# Altium schematic sheet ADC_DAC_channel.SchDoc: RFMC
size 420 x 297 mm; CompanyName: WUT; DrawnBy: T. Przywozki; Organization: WUT ISE; Address1: Warsaw University of Technology; Address2: Nowowiejska 15/19 00-665 Warsaw; Address3: Tomasz.Przywozki@pw.edu.pl; Revision: 1; SheetNumber: 4; SheetTotal: 4; Project: RFMC; ModifiedBy: -; CheckedDate: -; Title2: ADC_DAC_channel; DivGrp: ISE; Designer: T. Przywozki; ModifiedDate: -; ProjectName: ADC/DAC MEZZANINE
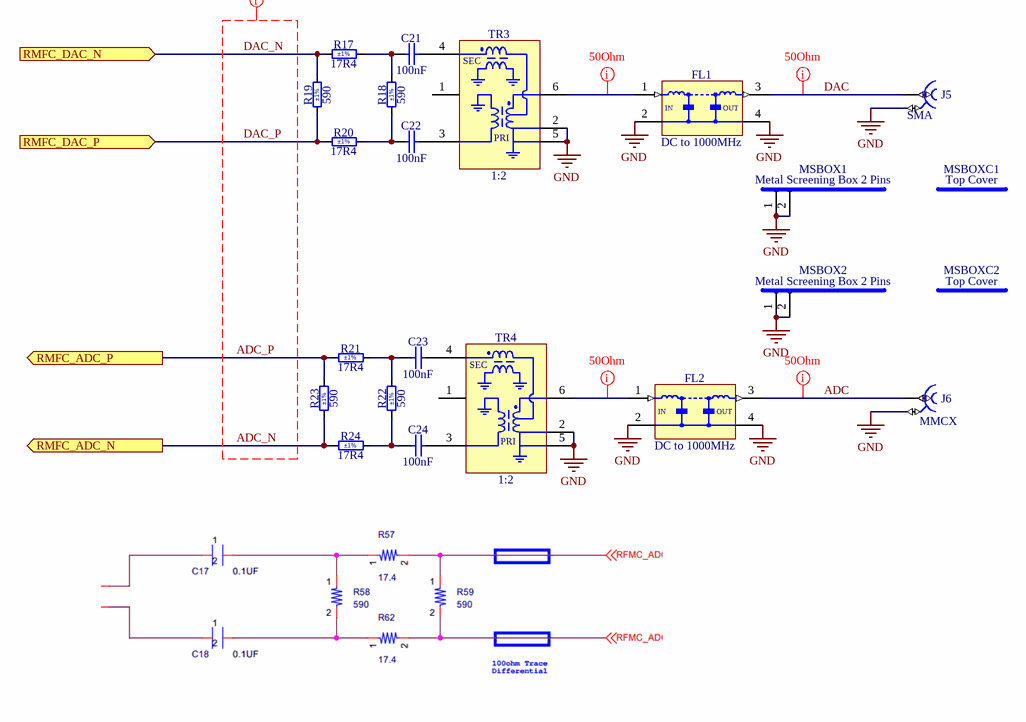
[diagram p0: ADC_DAC_channel.SchDoc]

## Parts
C21  100nF  [CAPC1005X55N]
C22  100nF  [CAPC1005X55N]
C23  100nF  [CAPC1005X55N]
C24  100nF  [CAPC1005X55N]
FL1  DC to 1000MHz  [FIL_MINI-CIRCUITS_FV1206]
FL2  DC to 1000MHz  [FIL_MINI-CIRCUITS_FV1206]
J5  SMA  [TELEGARTNER_J01151A0451]
J6  Family: MMCX  [HUBER-SUHNER_85_MMCX-50-0-1/111_OE]  (hidden comment: Coax_1Female_1Shield)
MSBOX1  Metal Screening Box 2 Pins  [MSBOX_WURTH_3670130]
MSBOX2  Metal Screening Box 2 Pins  [MSBOX_WURTH_3670130]
MSBOXC1  Top Cover  [MSBOX_WURTH_3671130]
MSBOXC2  Top Cover  [MSBOX_WURTH_3671130]
R17  17R4  Tolerance: ±1%  [RESC1005X40N]
R18  590  Tolerance: ±1%  [RESC1005X40N]
R19  590  Tolerance: ±1%  [RESC1005X40N]
R20  17R4  Tolerance: ±1%  [RESC1005X40N]
R21  17R4  Tolerance: ±1%  [RESC1005X40N]
R22  590  Tolerance: ±1%  [RESC1005X40N]
R23  590  Tolerance: ±1%  [RESC1005X40N]
R24  17R4  Tolerance: ±1%  [RESC1005X40N]
TR3  1:2  [XFMR_MINI-CIRCUITS_DB1627]
TR4  1:2  [XFMR_MINI-CIRCUITS_DB1627]

## Ports
RMFC_ADC_N (out), RMFC_ADC_P (out), RMFC_DAC_N (in), RMFC_DAC_P (in)

## Nets
GND: FL1.2(GND) FL1.4(GND) FL2.2(GND) FL2.4(GND) J5.2 J6.2 MSBOX1.1 MSBOX1.2 MSBOX2.1 MSBOX2.2 TR3.2(P) TR3.5(GND) TR4.2(P) TR4.5(GND)
ADC: FL2.3(RFOUT) J6.1
ADC_N: R23.1 R24.1 ; port RMFC_ADC_N
ADC_P: R21.1 R23.2 ; port RMFC_ADC_P
DAC: FL1.3(RFOUT) J5.1
DAC_N: R17.1 R19.2 ; port RMFC_DAC_N
DAC_P: R19.1 R20.1 ; port RMFC_DAC_P
NetC21_1: C21.1 R17.2 R18.2
NetC21_2: C21.2 TR3.4(SD)
NetC22_1: C22.1 R18.1 R20.2
NetC22_2: C22.2 TR3.3(S)
NetC23_1: C23.1 R21.2 R22.2
NetC23_2: C23.2 TR4.4(SD)
NetC24_1: C24.1 R22.1 R24.2
NetC24_2: C24.2 TR4.3(S)
NetFL1_1: FL1.1(RFIN) TR3.6(P1)
NetFL2_1: FL2.1(RFIN) TR4.6(P1)

Not connected (* = marked no-connect by the designer): TR3 1(NC); TR4 1(NC)

## Layout directives
net class SE50; net class ANALOG: ADC, DAC, NetFL1_1, NetFL2_1
net class ANALOG: ADC_N, ADC_P, DAC_N, DAC_P

## Notes on the sheet
- Project/Equipment
- Document
- Designer
- Drawn by
- Check.by
- Copyright WUT ISE 2021
  This documentation describes Open Hardware and is licensed under CERN OHL v.1.1. You may redistribute and modify this documentaction under the terms of the CERN OHL v1.1.
  (http://ohwr.org/CERNOHL). This documentation is dristributed WITHOUT ANY EXPRESS OR IMPLIED WARRANTY, INCLUDING OF MERCHANTABLITY, SATISFACTORY QUALITY AND FITNESS FOR A PARTICULAR PURPOSE. Please see the CERN OHL v.1.1 for applicable conditions
- File
- Last Mod.
- Print Date
- Sheet
- Size
- A3
- of
- Rev
- Contact:
- (in symbol FIL_MINI-CIRCUITS_LFCN-1000+) IN; OUT
- (in symbol XFMR_MINI-CIRCUITS_TCM2-33WX+) SEC; PRI

## Library data of the parts
C21-C24 = CC0402_100NF_16V_10%_X5R: Non-polarised capacitor; Part Description: SMD Multilayer Chip Ceramic Capacitor; Manufacturer: GENERIC; Manufacturer1 Part Number: GRM155R61C104KA88D; Voltage: 16V; TC: X5R; Tolerance: ±10%; Part Number: CC0402_100NF_16V_10%_X5R; Component Kind: Standard; Component Type: Standard; Pin Count: 2; Value: 100nF; Status: None; Manufacturer Part Number: CC0402_100NF_16V_10%_X5R; Case: 0402; Mounted: Yes; Socket: No; SMD: Yes; Sense: No; Manufacturer1 Example: MURATA; Manufacturer1 ComponentHeight: 0.55mm; HelpURL: \\cern.ch\dfs\Applications\Altium\Datasheets\CC0402_X5R_MURATA_GRM.pdf; Author: CERN DEM JLC; CreateDate: 10.12.2013; LatestRevisionDate: 10.12.2013
FL1 FL2 = FIL_MINI-CIRCUITS_LFCN-1000+: 50 Ohm Low Pass Filter; Part Number: FIL_MINI-CIRCUITS_LFCN-1000+; Component Kind: Standard; Component Type: Standard; Pin Count: 4; Value: DC to 1000MHz; Status: None; Part Description: 50 Ohm Low Pass Filter; Manufacturer: MINI-CIRCUITS; Manufacturer Part Number: LFCN-1000+; Mounted: Yes; Socket: No; SMD: Yes; Sense: No; ComponentHeight: 0.94mm; HelpURL: \\cern.ch\dfs\Applications\Altium\Datasheets\FIL_MINI-CIRCUITS_LFCN-1000+.pdf; Author: CERN DEM MR; CreateDate: 05.04.2019; LatestRevisionDate: 05.04.2019
J5 = TELEGARTNER_J01151A0451: Part Description: SMA 50 ohms Edge Mount Bulkhead Jack Receptacle; PressFit: No; Part Number: TELEGARTNER_J01151A0451; Component Kind: Standard; Component Type: Standard; Pin Count: 2; Family: SMA; Mounted: Yes; Socket: No; SMD: No; Sense: No; Status: None; Manufacturer: TELEGARTNER; Manufacturer Part Number: J01151A0451; ComponentHeight: 7mm; HelpURL: \\cern.ch\dfs\Applications\Altium\Datasheets\TELEGARTNER_J01151A0451.pdf; Author: CERN DEM JLC; CreateDate: 27.10.2016; LatestRevisionDate: 27.10.2016
J6 = HUBER-SUHNER_85_MMCX-50-0-1/111_OE: Part Description: MMCX 50 Ohms Right Angle PCB Jack; Manufacturer: HUBER+SUHNER; PressFit: No; Part Number: HUBER-SUHNER_85_MMCX-50-0-1/111_OE; Component Kind: Standard; Component Type: Standard; Pin Count: 2; Mounted: Yes; Socket: No; SMD: No; Sense: No; Status: None; Manufacturer Part Number: 85_MMCX-50-0-1/111_OE; ComponentHeight: 9.6mm; HelpURL: \\cern.ch\dfs\Applications\Altium\Datasheets\HUBER-SUHNER_85_MMCX-50-0-1-111_OE.pdf; Author: CERN DEM JLC; CreateDate: 06.11.2014; LatestRevisionDate: 06.11.2014
MSBOX1 MSBOX2 = MSBOX_WURTH_3670130: Part Description: Seamless Shielding Cabinet SMD-Frame WE-SHC (Two-Piece), Internal Dimensions 12.4 x 12.4mm; Manufacturer: WURTH; PressFit: No; Part Number: MSBOX_WURTH_3670130; Component Kind: Standard; Component Type: Standard; Pin Count: 2; PackageDescription: Seamless Shielding Cabinet SMD-Frame WE-SHC (Two-Piece), Internal Dimensions 12.4 x 12.4mm; Mounted: Yes; Socket: No; SMD: Yes; Sense: No; Status: None; Manufacturer Part Number: 3670130; ComponentHeight: 5.2mm; HelpURL: \\cern.ch\dfs\Applications\Altium\Datasheets\MSBOX_WURTH_3670130.pdf; Author: CERN DEM BC; CreateDate: 19.04.2021; LatestRevisionDate: 19.04.2021
MSBOXC1 MSBOXC2 = MSBOX_WURTH_3671130: Metal Screening Box - Top Cover 0 Pin; Part Description: Top Cover For Frame WE-SHC (Two-Piece) Seamless Shielding Cabinet, Internal Dimensions 12.4 x 12.4mm; Manufacturer: WURTH; PressFit: No; Part Number: MSBOX_WURTH_3671130; Component Kind: Accessories; Component Type: Standard; Pin Count: 0; PackageDescription: Top Cover For Frame WE-SHC (Two-Piece) Seamless Shielding Cabinet, Internal Dimensions 12.4 x 12.4mm; Mounted: Yes; Socket: No; SMD: No; Sense: No; Status: None; Manufacturer Part Number: 3671130; ComponentHeight: 3mm; HelpURL: \\cern.ch\dfs\Applications\Altium\Datasheets\MSBOX_WURTH_3671130.pdf; Author: CERN DEM BC; CreateDate: 19.04.2021; LatestRevisionDate: 19.04.2021
R17 R20 R21 R24 = R0402_17R4_1%_0.1W_100PPM: Resistor - 1%; Part Description: General Purpose Thick Film Chip Resistor; Manufacturer: GENERIC; Manufacturer1 Part Number: ERJ2RKF17R4X; Power: 0.1W; TC: ±100ppm/°C; Voltage: 50V; PressFit: No; Part Number: R0402_17R4_1%_0.1W_100PPM; Component Kind: Standard; Component Type: Standard; Pin Count: 2; Value: 17R4; Status: Not Recommended; Manufacturer Part Number: R0402_17R4_1%_0.1W_100PPM; Case: 0402; Mounted: Yes; Sense: No; Socket: No; SMD: Yes; Manufacturer1 Example: PANASONIC; Manufacturer1 ComponentHeight: 0.4mm; HelpURL: \\cern.ch\dfs\Applications\Altium\Datasheets\R0402_PANASONIC_ERJ2RK.pdf; Author: CERN DEM BC; CreateDate: 19.04.2021; LatestRevisionDate: 19.04.2021
R18 R19 R22 R23 = R0402_590R_1%_0.1W_100PPM: Resistor - 1%; Part Description: General Purpose Thick Film Chip Resistor; Manufacturer: GENERIC; Manufacturer1 Part Number: ERJ2RKF5900X; Power: 0.1W; TC: ±100ppm/°C; Voltage: 50V; PressFit: No; Part Number: R0402_590R_1%_0.1W_100PPM; Component Kind: Standard; Component Type: Standard; Pin Count: 2; Value: 590; Status: Not Recommended; Manufacturer Part Number: R0402_590R_1%_0.1W_100PPM; Case: 0402; Mounted: Yes; Sense: No; Socket: No; SMD: Yes; Manufacturer1 Example: PANASONIC; Manufacturer1 ComponentHeight: 0.4mm; HelpURL: \\cern.ch\dfs\Applications\Altium\Datasheets\R0402_PANASONIC_ERJ2RK.pdf; Author: CERN DEM BC; CreateDate: 19.04.2021; LatestRevisionDate: 19.04.2021
TR3 TR4 = XFMR_MINI-CIRCUITS_TCM2-33WX+: 50 OHMS 10 to 3000 MHz RF Transformer; Power: 0.4W; Part Number: XFMR_MINI-CIRCUITS_TCM2-33WX+; Component Kind: Standard; Component Type: Standard; Pin Count: 6; Value: 1:2; Status: None; Part Description: 50 Ohms 10 to 3000MHz RF Transformer; Manufacturer: MINI-CIRCUITS; Manufacturer Part Number: TCM2-33WX+; Mounted: Yes; Socket: No; Sense: No; SMD: Yes; ComponentHeight: 4.06mm; HelpURL: \\cern.ch\dfs\Applications\Altium\Datasheets\XFMR_MINI-CIRCUITS_TCM2-33WX+.pdf; Author: CERN DEM MR; CreateDate: 01.12.2016; LatestRevisionDate: 01.12.2016